# EAGLE schematic module (EAGLE 9.0.1)
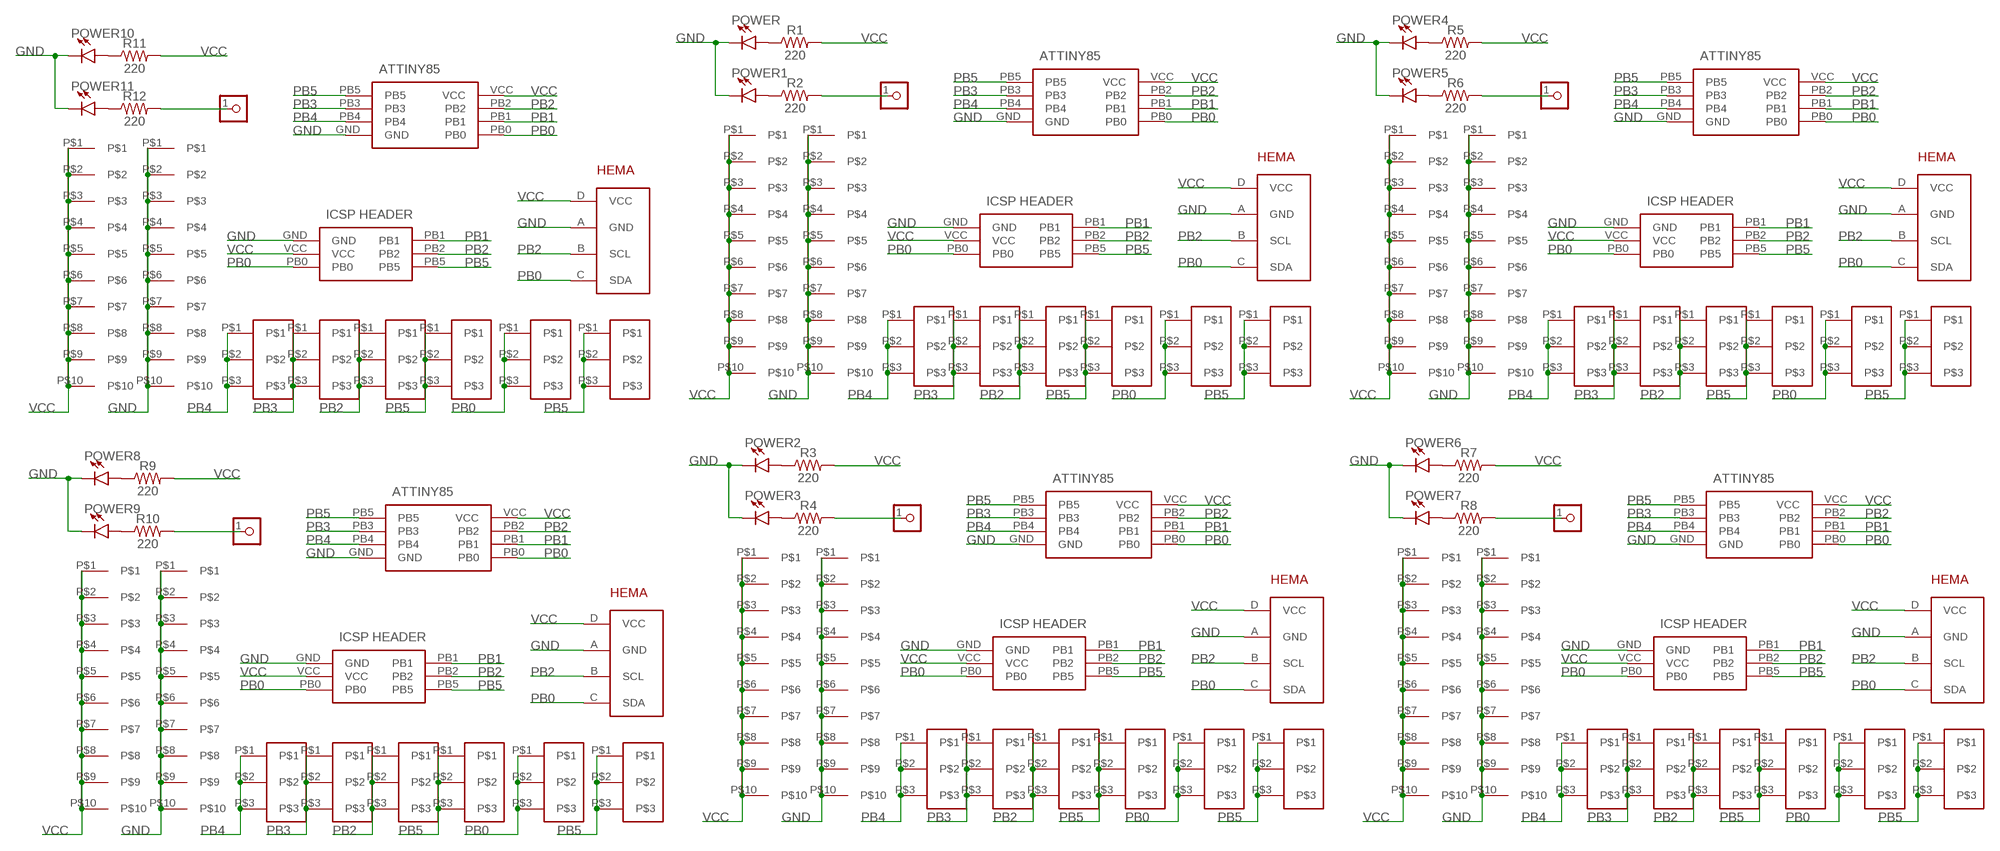
[diagram p0: schematic, sheet 1]

## Parts
0  3X-PADS-CONNECTED  [3X-PADS]
1  3X-PADS-CONNECTED  [3X-PADS]
2  3X-PADS-CONNECTED  [3X-PADS]
3  3X-PADS-CONNECTED  [3X-PADS]
4  3X-PADS-CONNECTED  [3X-PADS]
5  3X-PADS-CONNECTED  [3X-PADS]
6  3X-PADS-CONNECTED  [3X-PADS]
7  3X-PADS-CONNECTED  [3X-PADS]
8  3X-PADS-CONNECTED  [3X-PADS]
9  3X-PADS-CONNECTED  [3X-PADS]
10  3X-PADS-CONNECTED  [3X-PADS]
11  3X-PADS-CONNECTED  [3X-PADS]
12  3X-PADS-CONNECTED  [3X-PADS]
13  3X-PADS-CONNECTED  [3X-PADS]
14  3X-PADS-CONNECTED  [3X-PADS]
15  3X-PADS-CONNECTED  [3X-PADS]
16  3X-PADS-CONNECTED  [3X-PADS]
17  3X-PADS-CONNECTED  [3X-PADS]
18  3X-PADS-CONNECTED  [3X-PADS]
19  3X-PADS-CONNECTED  [3X-PADS]
20  3X-PADS-CONNECTED  [3X-PADS]
21  3X-PADS-CONNECTED  [3X-PADS]
22  3X-PADS-CONNECTED  [3X-PADS]
23  3X-PADS-CONNECTED  [3X-PADS]
24  3X-PADS-CONNECTED  [3X-PADS]
25  3X-PADS-CONNECTED  [3X-PADS]
26  3X-PADS-CONNECTED  [3X-PADS]
27  3X-PADS-CONNECTED  [3X-PADS]
28  3X-PADS-CONNECTED  [3X-PADS]
29  3X-PADS-CONNECTED  [3X-PADS]
30  3X-PADS-CONNECTED  [3X-PADS]
31  3X-PADS-CONNECTED  [3X-PADS]
32  3X-PADS-CONNECTED  [3X-PADS]
33  3X-PADS-CONNECTED  [3X-PADS]
34  3X-PADS-CONNECTED  [3X-PADS]
35  3X-PADS-CONNECTED  [3X-PADS]
GND  10X-PADS  [10X-PADS]
GND1  10X-PADS  [10X-PADS]
GND2  10X-PADS  [10X-PADS]
GND3  10X-PADS  [10X-PADS]
GND4  10X-PADS  [10X-PADS]
GND5  10X-PADS  [10X-PADS]
IC1  ATTINY85-20SU  [SOT127P798X216-8N]
IC2  ATTINY85-20SU  [SOT127P798X216-8N]
IC3  ATTINY85-20SU  [SOT127P798X216-8N]
IC4  ATTINY85-20SU  [SOT127P798X216-8N]
IC5  ATTINY85-20SU  [SOT127P798X216-8N]
IC6  ATTINY85-20SU  [SOT127P798X216-8N]
J1  M20-9980346  [HDRV6W64P254_2X3_762X508X868P]
J2  M20-9980346  [HDRV6W64P254_2X3_762X508X868P]
J3  M20-9980346  [HDRV6W64P254_2X3_762X508X868P]
J4  M20-9980346  [HDRV6W64P254_2X3_762X508X868P]
J5  M20-9980346  [HDRV6W64P254_2X3_762X508X868P]
J6  M20-9980346  [HDRV6W64P254_2X3_762X508X868P]
P1  PROTO_VIAS_01X01-1.2  [PROTO_VIAS_01X01_1.2]
P2  PROTO_VIAS_01X01-1.2  [PROTO_VIAS_01X01_1.2]
P3  PROTO_VIAS_01X01-1.2  [PROTO_VIAS_01X01_1.2]
P4  PROTO_VIAS_01X01-1.2  [PROTO_VIAS_01X01_1.2]
P5  PROTO_VIAS_01X01-1.2  [PROTO_VIAS_01X01_1.2]
P6  PROTO_VIAS_01X01-1.2  [PROTO_VIAS_01X01_1.2]
POWER  LED3MM  [LED_3MM]
POWER1  LED3MM  [LED_3MM]
POWER2  LED3MM  [LED_3MM]
POWER3  LED3MM  [LED_3MM]
POWER4  LED3MM  [LED_3MM]
POWER5  LED3MM  [LED_3MM]
POWER6  LED3MM  [LED_3MM]
POWER7  LED3MM  [LED_3MM]
POWER8  LED3MM  [LED_3MM]
POWER9  LED3MM  [LED_3MM]
POWER10  LED3MM  [LED_3MM]
POWER11  LED3MM  [LED_3MM]
R1  220  RESISTORAXIAL-0.3  [AXIAL-0.3]
R2  220  RESISTORAXIAL-0.3  [AXIAL-0.3]
R3  220  RESISTORAXIAL-0.3  [AXIAL-0.3]
R4  220  RESISTORAXIAL-0.3  [AXIAL-0.3]
R5  220  RESISTORAXIAL-0.3  [AXIAL-0.3]
R6  220  RESISTORAXIAL-0.3  [AXIAL-0.3]
R7  220  RESISTORAXIAL-0.3  [AXIAL-0.3]
R8  220  RESISTORAXIAL-0.3  [AXIAL-0.3]
R9  220  RESISTORAXIAL-0.3  [AXIAL-0.3]
R10  220  RESISTORAXIAL-0.3  [AXIAL-0.3]
R11  220  RESISTORAXIAL-0.3  [AXIAL-0.3]
R12  220  RESISTORAXIAL-0.3  [AXIAL-0.3]
U$1  HEMA-I2C  [HEMA-I2C]
U$2  HEMA-I2C  [HEMA-I2C]
U$3  HEMA-I2C  [HEMA-I2C]
U$4  HEMA-I2C  [HEMA-I2C]
U$5  HEMA-I2C  [HEMA-I2C]
U$6  HEMA-I2C  [HEMA-I2C]
VCC  10X-PADS  [10X-PADS]
VCC1  10X-PADS  [10X-PADS]
VCC2  10X-PADS  [10X-PADS]
VCC3  10X-PADS  [10X-PADS]
VCC4  10X-PADS  [10X-PADS]
VCC5  10X-PADS  [10X-PADS]

## Nets
GND [GND]: GND1.P$1 GND1.P$2 GND1.P$3 GND1.P$4 GND1.P$5 GND1.P$6 GND1.P$7 GND1.P$8 GND1.P$9 GND1.P$10 GND2.P$1 GND2.P$2 GND2.P$3 GND2.P$4 GND2.P$5 GND2.P$6 GND2.P$7 GND2.P$8 GND2.P$9 GND2.P$10 GND3.P$1 GND3.P$2 GND3.P$3 GND3.P$4 GND3.P$5 GND3.P$6 GND3.P$7 GND3.P$8 GND3.P$9 GND3.P$10 GND4.P$1 GND4.P$2 GND4.P$3 GND4.P$4 GND4.P$5 GND4.P$6 GND4.P$7 GND4.P$8 GND4.P$9 GND4.P$10 GND5.P$1 GND5.P$2 GND5.P$3 GND5.P$4 GND5.P$5 GND5.P$6 GND5.P$7 GND5.P$8 GND5.P$9 GND5.P$10 GND.P$1 GND.P$2 GND.P$3 GND.P$4 GND.P$5 GND.P$6 GND.P$7 GND.P$8 GND.P$9 GND.P$10 IC1.GND IC2.GND IC3.GND IC4.GND IC5.GND IC6.GND J1.GND J2.GND J3.GND J4.GND J5.GND J6.GND POWER1.K(C) POWER2.K(C) POWER3.K(C) POWER4.K(C) POWER5.K(C) POWER6.K(C) POWER7.K(C) POWER8.K(C) POWER9.K(C) POWER10.K(C) POWER11.K(C) POWER.K(C) U$1.A(GND) U$2.A(GND) U$3.A(GND) U$4.A(GND) U$5.A(GND) U$6.A(GND)
N$1: POWER1.A R2.P$1
N$2: P1.1 R2.P$2
N$3: POWER2.A R3.P$1
N$4: POWER3.A R4.P$1
N$5: P2.1 R4.P$2
N$6: POWER4.A R5.P$1
N$7: POWER5.A R6.P$1
N$8: P3.1 R6.P$2
N$9: POWER6.A R7.P$1
N$10: POWER7.A R8.P$1
N$11: POWER.A R1.P$1
N$12: P4.1 R8.P$2
N$13: POWER8.A R9.P$1
N$14: POWER9.A R10.P$1
N$15: P5.1 R10.P$2
N$16: POWER10.A R11.P$1
N$17: POWER11.A R12.P$1
N$18: P6.1 R12.P$2
PB0: 0.P$1 0.P$2 0.P$3 10.P$1 10.P$2 10.P$3 16.P$1 16.P$2 16.P$3 22.P$1 22.P$2 22.P$3 28.P$1 28.P$2 28.P$3 34.P$1 34.P$2 34.P$3 IC1.PB0 IC2.PB0 IC3.PB0 IC4.PB0 IC5.PB0 IC6.PB0 J1.PB0 J2.PB0 J3.PB0 J4.PB0 J5.PB0 J6.PB0 U$1.C(SDA) U$2.C(SDA) U$3.C(SDA) U$4.C(SDA) U$5.C(SDA) U$6.C(SDA)
PB1: IC1.PB1 IC2.PB1 IC3.PB1 IC4.PB1 IC5.PB1 IC6.PB1 J1.PB1 J2.PB1 J3.PB1 J4.PB1 J5.PB1 J6.PB1
PB2: 2.P$1 2.P$2 2.P$3 8.P$1 8.P$2 8.P$3 14.P$1 14.P$2 14.P$3 20.P$1 20.P$2 20.P$3 26.P$1 26.P$2 26.P$3 32.P$1 32.P$2 32.P$3 IC1.PB2 IC2.PB2 IC3.PB2 IC4.PB2 IC5.PB2 IC6.PB2 J1.PB2 J2.PB2 J3.PB2 J4.PB2 J5.PB2 J6.PB2 U$1.B(SCL) U$2.B(SCL) U$3.B(SCL) U$4.B(SCL) U$5.B(SCL) U$6.B(SCL)
PB3: 3.P$1 3.P$2 3.P$3 7.P$1 7.P$2 7.P$3 13.P$1 13.P$2 13.P$3 19.P$1 19.P$2 19.P$3 25.P$1 25.P$2 25.P$3 31.P$1 31.P$2 31.P$3 IC1.PB3 IC2.PB3 IC3.PB3 IC4.PB3 IC5.PB3 IC6.PB3
PB4: 4.P$1 4.P$2 4.P$3 6.P$1 6.P$2 6.P$3 12.P$1 12.P$2 12.P$3 18.P$1 18.P$2 18.P$3 24.P$1 24.P$2 24.P$3 30.P$1 30.P$2 30.P$3 IC1.PB4 IC2.PB4 IC3.PB4 IC4.PB4 IC5.PB4 IC6.PB4
PB5: 1.P$1 1.P$2 1.P$3 5.P$1 5.P$2 5.P$3 9.P$1 9.P$2 9.P$3 11.P$1 11.P$2 11.P$3 15.P$1 15.P$2 15.P$3 17.P$1 17.P$2 17.P$3 21.P$1 21.P$2 21.P$3 23.P$1 23.P$2 23.P$3 27.P$1 27.P$2 27.P$3 29.P$1 29.P$2 29.P$3 33.P$1 33.P$2 33.P$3 35.P$1 35.P$2 35.P$3 IC1.PB5 IC2.PB5 IC3.PB5 IC4.PB5 IC5.PB5 IC6.PB5 J1.PB5 J2.PB5 J3.PB5 J4.PB5 J5.PB5 J6.PB5
VCC [VCC]: IC1.VCC IC2.VCC IC3.VCC IC4.VCC IC5.VCC IC6.VCC J1.VCC J2.VCC J3.VCC J4.VCC J5.VCC J6.VCC R1.P$2 R3.P$2 R5.P$2 R7.P$2 R9.P$2 R11.P$2 U$1.D(VCC) U$2.D(VCC) U$3.D(VCC) U$4.D(VCC) U$5.D(VCC) U$6.D(VCC) VCC1.P$1 VCC1.P$2 VCC1.P$3 VCC1.P$4 VCC1.P$5 VCC1.P$6 VCC1.P$7 VCC1.P$8 VCC1.P$9 VCC1.P$10 VCC2.P$1 VCC2.P$2 VCC2.P$3 VCC2.P$4 VCC2.P$5 VCC2.P$6 VCC2.P$7 VCC2.P$8 VCC2.P$9 VCC2.P$10 VCC3.P$1 VCC3.P$2 VCC3.P$3 VCC3.P$4 VCC3.P$5 VCC3.P$6 VCC3.P$7 VCC3.P$8 VCC3.P$9 VCC3.P$10 VCC4.P$1 VCC4.P$2 VCC4.P$3 VCC4.P$4 VCC4.P$5 VCC4.P$6 VCC4.P$7 VCC4.P$8 VCC4.P$9 VCC4.P$10 VCC5.P$1 VCC5.P$2 VCC5.P$3 VCC5.P$4 VCC5.P$5 VCC5.P$6 VCC5.P$7 VCC5.P$8 VCC5.P$9 VCC5.P$10 VCC.P$1 VCC.P$2 VCC.P$3 VCC.P$4 VCC.P$5 VCC.P$6 VCC.P$7 VCC.P$8 VCC.P$9 VCC.P$10

## Library data of the parts
0 1-35 = BadgeParts:3X-PADS-CONNECTED
GND GND1-GND5 VCC VCC1-VCC5 = BadgeParts:10X-PADS
IC1-IC6 = BadgeParts:ATTINY85-20SU: MICROCHIP - ATTINY85-20SU - MICROCONTROLLER MCU, 8 BIT, ATTINY, 20MHZ, SOIC-8 Source: Datasheet <https://componentsearchengine.com/Datasheets/2/ATTINY85-20SU.pdf>; ARROW_PART_NUMBER: ATTINY85-20SU; ARROW_PRICE/STOCK: https://www.arrow.com/en/products/attiny85-20su/microchip-technology; DESCRIPTION: MICROCHIP - ATTINY85-20SU - MICROCONTROLLER MCU, 8 BIT, ATTINY, 20MHZ, SOIC-8; HEIGHT: 2.16mm; MANUFACTURER_NAME: Microchip; MANUFACTURER_PART_NUMBER: ATTINY85-20SU; RS_PART_NUMBER: 1331674; RS_PRICE/STOCK: http://uk.rs-online.com/web/p/products/1331674
J1-J6 = BadgeParts:M20-9980346: 03+03 DIL Vertical Pin Header HARWIN M20 Series, 2.54mm Pitch 6 Way 2 Row Straight PCB Header, Solder Termination, 3A Source: Datasheet <https://cdn.harwin.com/pdfs/M20-998.pdf?utm_source=3D_PDF&utm_medium=3D_PDF&utm_campaign=3D_PDF>; ARROW_PART_NUMBER: M20-9980346; ARROW_PRICE/STOCK: http://uk.rs-online.com/web/p/products/7457046P; DESCRIPTION: 03+03 DIL Vertical Pin Header HARWIN M20 Series, 2.54mm Pitch 6 Way 2 Row Straight PCB Header, Solder Termination, 3A; HEIGHT: 8.68mm; MANUFACTURER_NAME: HARWIN; MANUFACTURER_PART_NUMBER: M20-9980346; RS_PART_NUMBER: 7457046P; RS_PRICE/STOCK: http://uk.rs-online.com/web/p/products/7457046P
P1-P6 = dp_devices:PROTO_VIAS_01X01: Single Pad for Protoboard Filling
POWER POWER1-POWER11 = SparkFun-LED:LED: LED (Generic) Standard schematic elements and footprints for 5mm, 3mm, 1206, and 0603 sized LEDs. Generic LEDs with no color specified.; PROD_ID: DIO-08794
R1-R12 = SparkFun-Resistors:RESISTOR: Generic Resistor Package
U$1-U$6 = BadgeParts:HEMA-I2C

## Net classes
0 default: width 0.254 mm, clearance 0.381 mm
1 VCC: width 0.635 mm, clearance 0.381 mm
2 GND: width 0.635 mm, clearance 0.381 mm